# Altium schematic sheet Sheet1.SchDoc
size A4
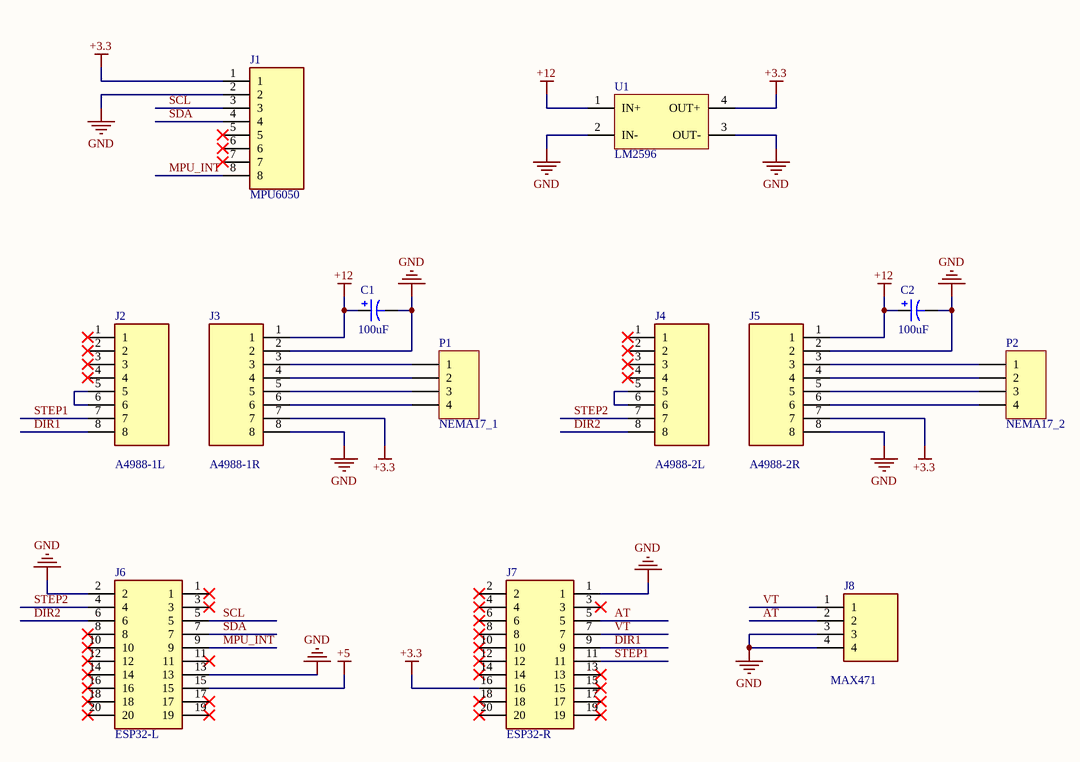
[diagram p0: Sheet1.SchDoc]

## Parts
C1  value 100uF  [CAP AL TH D10 L2.5 H12.5 - duplicate]  (hidden comment: Cap Pol1)
C2  value 100uF  [CAP AL TH D10 L2.5 H12.5 - duplicate]  (hidden comment: Cap Pol1)
J1  MPU6050  [SSQ10803TSLL]
J2  A4988-1L  [SSQ10803TSLL]
J3  A4988-1R  [SSQ10803TSLL]
J4  A4988-2L  [SSQ10803TSLL]
J5  A4988-2R  [SSQ10803TSLL]
J6  ESP32-L  [RHDR20W64P254_2X10_2591X495X851P]
J7  ESP32-R  [RHDR20W64P254_2X10_2591X495X851P]
J8  MAX471  [RHDR4W64P0X254_1X4_1067X241X851P]
P1  NEMA17_1  [JST XH B4B-XH-A]
P2  NEMA17_2  [JST XH B4B-XH-A]
U1  LM2596  [STEP_DOWN-LM2596]

## Nets
+3.3: J1.1 J3.7 J5.7 J7.16 U1.4(OUT+)
+5: J6.15
+12: C1.1 C2.1 J3.1 J5.1 U1.1(IN+)
GND: C1.2 C2.2 J1.2 J3.2 J3.8 J5.2 J5.8 J6.2 J6.13 J7.1 J8.3 J8.4 U1.2(IN-) U1.3(OUT-)
AT: J7.5 J8.2
DIR1: J2.8 J7.9
DIR2: J4.8 J6.6
MPU_INT: J1.8 J6.9
SCL: J1.3 J6.5
SDA: J1.4 J6.7
STEP1: J2.7 J7.11
STEP2: J4.7 J6.4
VT: J7.7 J8.1
NetJ2_5: J2.5 J2.6
NetJ3_3: J3.3 P1.1
NetJ3_4: J3.4 P1.2
NetJ3_5: J3.5 P1.3
NetJ3_6: J3.6 P1.4
NetJ4_5: J4.5 J4.6
NetJ5_3: J5.3 P2.1
NetJ5_4: J5.4 P2.2
NetJ5_5: J5.5 P2.3
NetJ5_6: J5.6 P2.4

Not connected (* = marked no-connect by the designer): J1 5* 6* 7*; J2 1* 2* 3* 4*; J4 1* 2* 3* 4*; J6 1* 3* 8* 10* 11* 12* 14* 16* 17* 18* 19* 20*; J7 2* 3* 4* 6* 8* 10* 12* 13* 14* 15* 17* 18* 19* 20*

## Notes on the sheet
- Title
- Size:
- Date:
- A4
- Number:
- Time:
- Revision:
- Sheet
- of
- File:

## Library data of the parts
C1 C2 = Cap Pol1: Polarized Capacitor (Radial); Published: 8-Jun-2000; LatestRevisionDate: 17-Jul-2002; LatestRevisionNote: Re-released for DXP Platform.; PackageReference: RB7.6-15; Publisher: Altium Limited; PackageDescription: Polarized Capacitor (Radial); 2 Leads
J1-J5 = SSQ-108-03-T-S-LL: Connector; Manufacturer_Name: SAMTEC; Datasheet Link: https://www.mouser.co.id/datasheet/2/527/ssq_th-1370157.pdf; Height: 8.51mm; Manufacturer_Part_Number: SSQ-108-03-T-S-LL; Arrow Part Number: SSQ-108-03-T-S-LL; Mouser Part Number: 200-SSQ-108-03-TSLL; Mouser Price/Stock: https://www.mouser.com/Search/Refine.aspx?Keyword=200-SSQ-108-03-TSLL
J6 J7 = SSQ-110-01-G-D-001: Connector; Manufacturer_Name: SAMTEC; Datasheet Link: http://suddendocs.samtec.com/catalog_english/ssq_th.pdf; Height: 8.51mm; Manufacturer_Part_Number: SSQ-110-01-G-D-001; Arrow Part Number: SSQ-110-01-G-D-001; Mouser Part Number: 200-SSQ11001GD001; Mouser Price/Stock: https://www.mouser.com/Search/Refine.aspx?Keyword=200-SSQ11001GD001
J8 = SSQ-104-01-G-S-003: Connector; Manufacturer_Name: SAMTEC; Datasheet Link: http://suddendocs.samtec.com/catalog_english/ssq_th.pdf; Height: 8.51mm; Manufacturer_Part_Number: SSQ-104-01-G-S-003; Arrow Part Number: SSQ-104-01-G-S-003
P1 P2 = Header 4: Header, 4-Pin; LatestRevisionDate: 17-Jul-2002; LatestRevisionNote: Re-released for DXP Platform.; Publisher: Altium Limited
U1 = STEP_DOWN-LM2596